# Altium schematic sheet 11-HALF_BRIDGE.SchDoc: INVERTER
size A3; Author: Alexandre Cosneau; CompanyName: Tristar Multicopters; DrawnBy: Alexandre Cosneau; Engineer: Alexandre Cosneau; Organization: Tristar Multicopters; Address1: Genie / GEGI; Address2: 2500 boulevard de l'universite; Address3: J1K2R SHERBROOKE; Address4: QUEBEC, CANADA; DocumentNumber: 4; Revision: 1.0; SheetNumber: 4; SheetTotal: 7
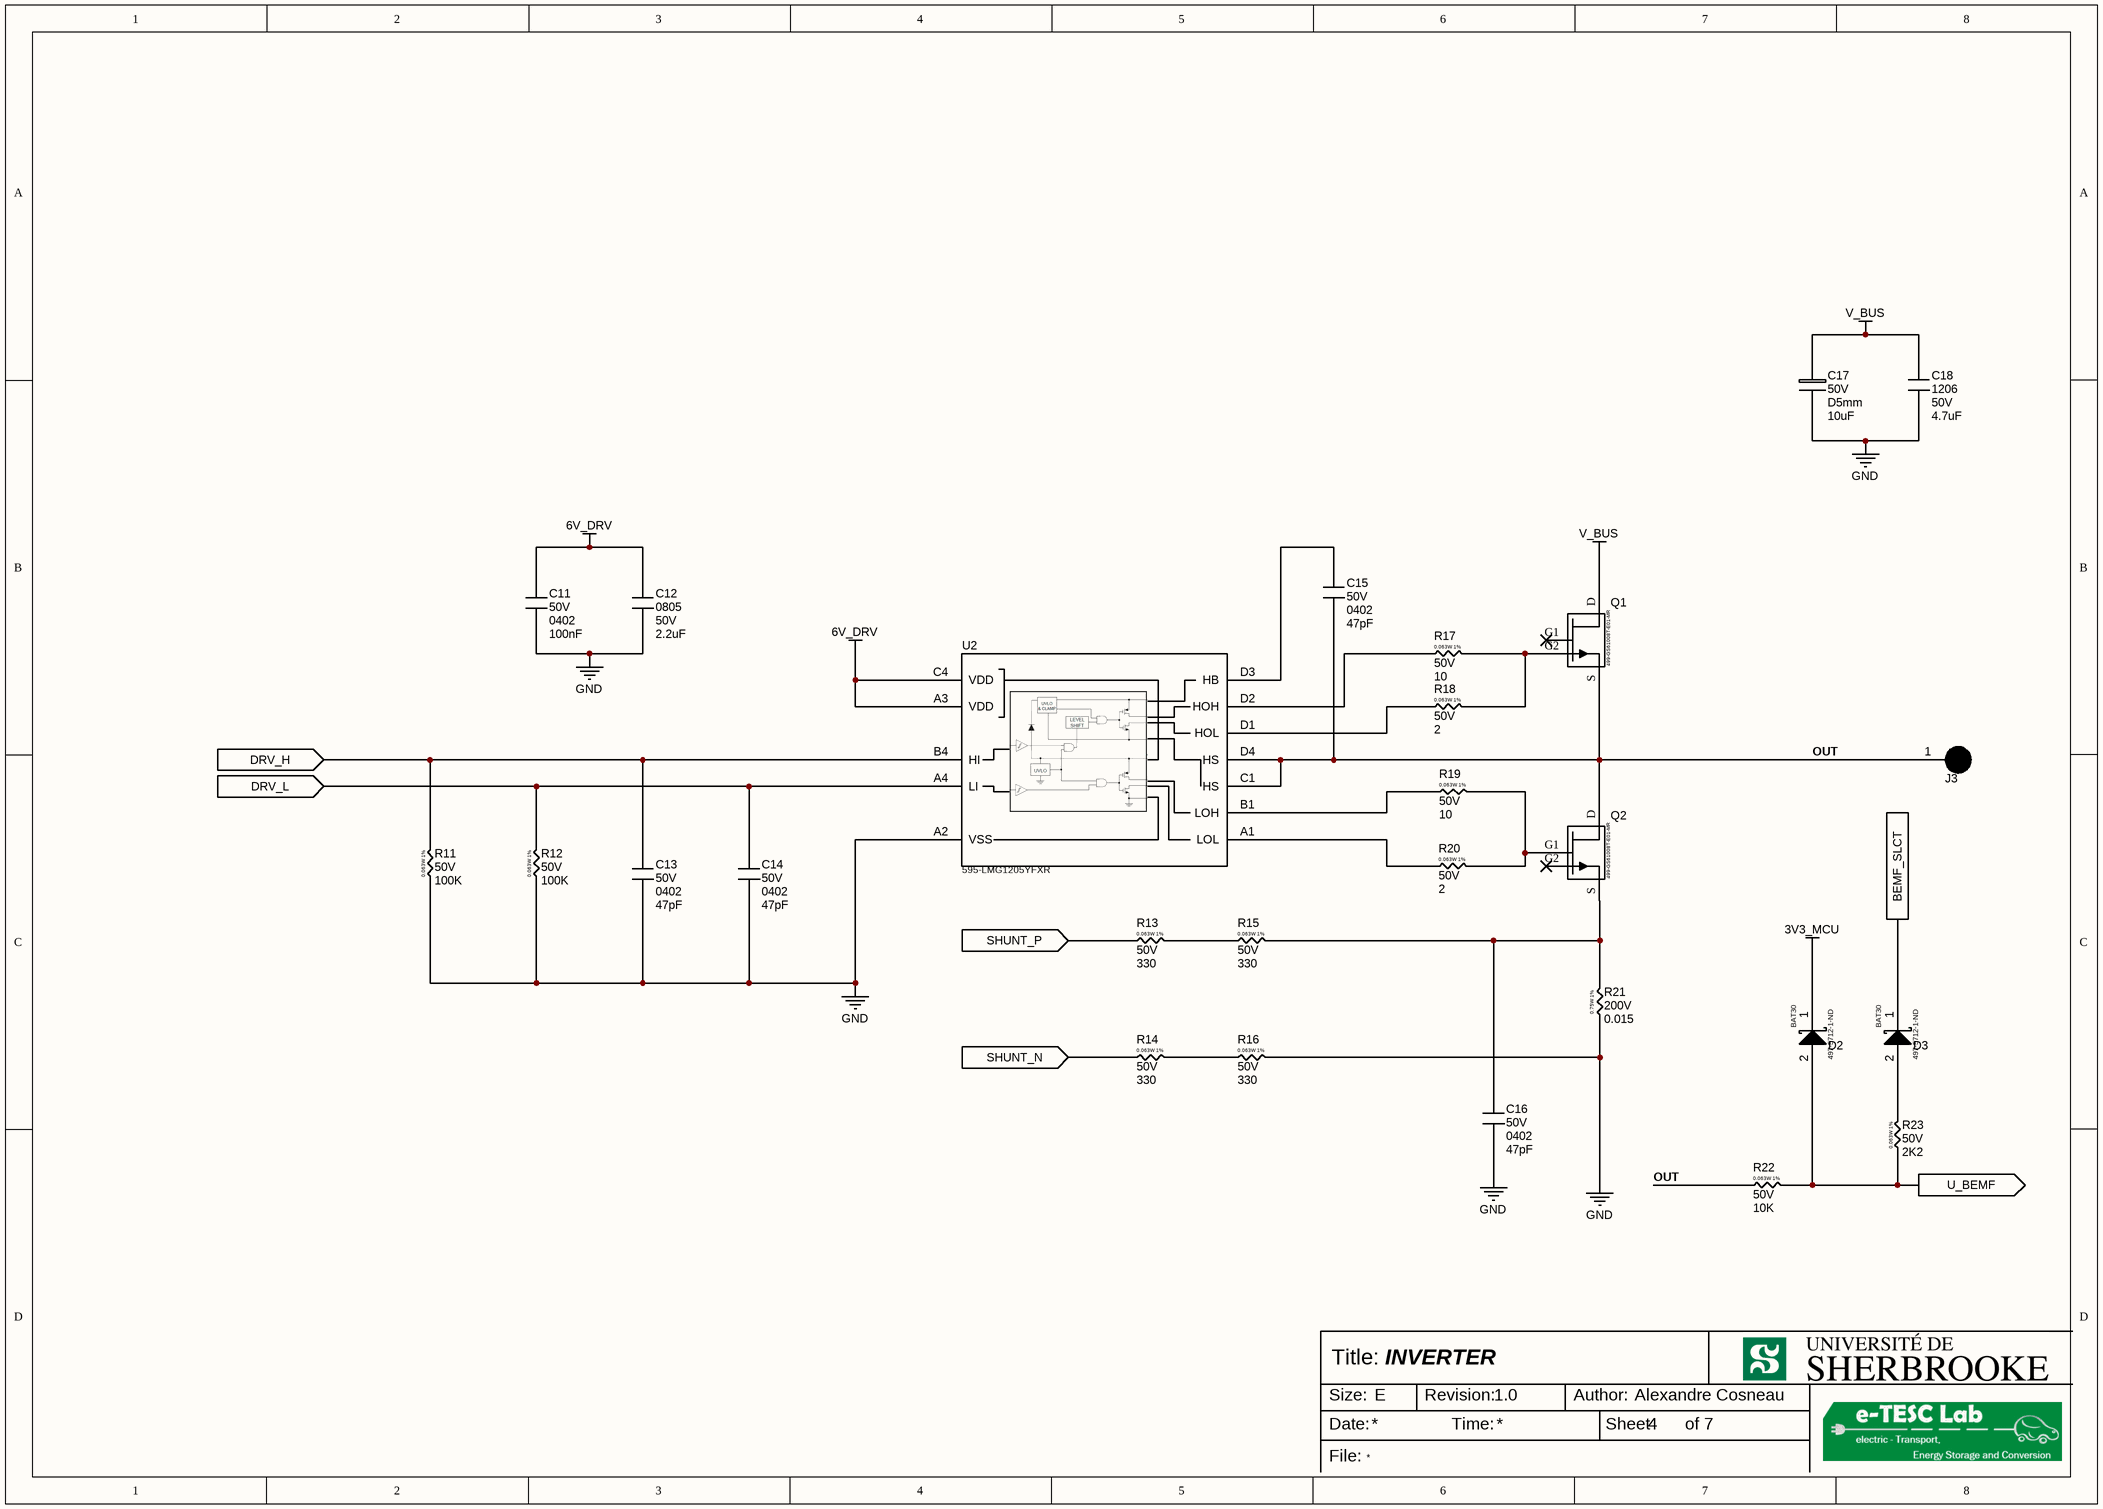
[diagram p0: 11-HALF_BRIDGE.SchDoc]

## Parts
C11  VDC: 50V  Package: 0402  [C 0402(1005)x0.5]  (hidden comment: 100nF)
C12  Package: 0805  VDC: 50V  [C 0805(2012)x0.65]  (hidden comment: 2.2uF)
C13  VDC: 50V  Package: 0402  [C 0402(1005)x0.5]  (hidden comment: 47pF)
C14  VDC: 50V  Package: 0402  [C 0402(1005)x0.5]  (hidden comment: 47pF)
C15  VDC: 50V  Package: 0402  [C 0402(1005)x0.5]  (hidden comment: 47pF)
C16  VDC: 50V  Package: 0402  [C 0402(1005)x0.5]  (hidden comment: 47pF)
C17  VDC: 50V  Package: D5mm  [EL SMD D5 h5.4]  (hidden comment: 10uF)
C18  Package: 1206  VDC: 50V  [C 1206(3216)x1.6]  (hidden comment: 4.7uF)
D2  Supplier Part Number 1: 497-5712-1-ND  [SOD-523]  (hidden comment: SOD523)
D3  Supplier Part Number 1: 497-5712-1-ND  [SOD-523]  (hidden comment: SOD523)
J3  PAD_3_RD  [PAD_03-03-RD]  (value not drawn)  (net tie, no BOM)
Q1  Supplier Part Number 1: 499-GS61008T-E01-MR  [GS61008T]  (hidden comment: GS61008T)
Q2  Supplier Part Number 1: 499-GS61008T-E01-MR  [GS61008T]  (hidden comment: GS61008T)
R11  VDC: 50V  [R 0402(1005)-1%]  (hidden comment: 100K)
R12  VDC: 50V  [R 0402(1005)-1%]  (hidden comment: 100K)
R13  VDC: 50V  [R 0402(1005)-1%]  (hidden comment: 330)
R14  VDC: 50V  [R 0402(1005)-1%]  (hidden comment: 330)
R15  VDC: 50V  [R 0402(1005)-1%]  (hidden comment: 330)
R16  VDC: 50V  [R 0402(1005)-1%]  (hidden comment: 330)
R17  VDC: 50V  [R 0402(1005)-1%]  (hidden comment: 10)
R18  VDC: 50V  [R 0402(1005)-1%]  (hidden comment: 2)
R19  VDC: 50V  [R 0402(1005)-1%]  (hidden comment: 10)
R20  VDC: 50V  [R 0402(1005)-1%]  (hidden comment: 2)
R21  VDC: 200V  [R 2010(5025)-1%]  (hidden comment: 0.015)
R22  VDC: 50V  [R 0402(1005)-1%]  (hidden comment: 10K)
R23  VDC: 50V  [R 0402(1005)-1%]  (hidden comment: 2K2)
U2  Supplier Part Number 2: 595-LMG1205YFXR  [DSBGA-12]  (hidden comment: LMG1205)

## Ports
BEMF_SLCT, DRV_H (in), DRV_L (in), SHUNT_N (in), SHUNT_P (in), U_BEMF (out)

## Nets
3V3_MCU: D2.1
6V_DRV: C11.1 C12.1 U2.A3(VDD) U2.C4(VDD)
GND: C11.2 C12.2 C13.2 C14.2 C16.2 C17.2 C18.2 R11.1 R12.1 R16.2 R21.1 U2.A2(VSS)
V_BUS: C17.1 C18.1 Q1.D
BEMF_SLCT: D3.1 ; port BEMF_SLCT
DRV_H: C13.1 R11.2 U2.B4(HI) ; port DRV_H
DRV_L: C14.1 R12.2 U2.A4(LI) ; port DRV_L
OUT: C15.2 J3.1 Q1.S Q2.D R22.1 U2.C1(HS) U2.D4(HS)
SHUNT_N: R14.1 ; port SHUNT_N
SHUNT_P: R13.1 ; port SHUNT_P
U_BEMF: D2.2 R22.2 R23.1 ; port U_BEMF
NetC15_1: C15.1 U2.D3(HB)
NetC16_1: C16.1 Q2.S R15.2 R21.2
NetD3_2: D3.2 R23.2
NetQ1_G2: Q1.G2 R17.2 R18.2
NetQ2_G1: Q2.G1 R19.2 R20.2
NetR13_2: R13.2 R15.1
NetR14_2: R14.2 R16.1
NetR17_1: R17.1 U2.D2(HOH)
NetR18_1: R18.1 U2.D1(HOL)
NetR19_1: R19.1 U2.B1(LOH)
NetR20_1: R20.1 U2.A1(LOL)

Not connected (* = marked no-connect by the designer): Q1 G1*; Q2 G2*

## Notes on the sheet
- Title:
- Size:
- Date:
- File:
- E
- Revision:
- Time:
- Author:
- Sheet
- of
- (in symbol RES 0402-1%) 0.063W 1%
- (in symbol RES 2010-1%) 0.75W 1%

## Library data of the parts
C11 C13-C16 = CAP 0402 100nF 50V X7R: SMD-0402 100nF 50V X7R 10%; Part Number: CL05B104KB5NNNC; Manufacturer: Samsung; TYPE: Capacitors; Package-mm: 1005; Mount Type: SMT; Publisher: Hefest; Manufacturer Alternate: *; Part Number Alternate: *; Published: 07.04.2019; Supplier 1: Comet; Supplier 2: *; Supplier 3: *; Supplier Part Number 1: C0402 100nF 50V X7R; Supplier Part Number 2: *; Supplier Part Number 3: *; RoHS: Y; Technology: Ceramic  MLCC; Value 1: *; Value 2: *; TempCo: X7R; Tolerance %: ±10%; VAC: *; ESR Ohm: *; ComponentLink1Description: Datasheet link; ComponentLink1URL: https://store.comet.bg/download-file.php?id=11; Temperature Range: -55°C ~ +125°C; Price: 0.039
  C11: Value: 100nF
  C13-C16: Value: 47pF
C12 = CAP 0805 2.2nF 50V X7R: SMD-0805 50V X7R 10%; Part Number: CL21B222KBNC; Manufacturer: Samsung; TYPE: Capacitors; Package-mm: 2012; Mount Type: SMT; Publisher: Hefest; Manufacturer Alternate: *; Part Number Alternate: *; Published: 07.04.2019; Supplier 1: Comet; Supplier 2: *; Supplier 3: *; Supplier Part Number 1: C0805 2.2nF 50V X7R SAMSUNG; Supplier Part Number 2: *; Supplier Part Number 3: *; RoHS: Y; Technology: Ceramic  MLCC; Value 1: *; Value 2: *; TempCo: X7R; Tolerance %: ±10%; VAC: *; ESR Ohm: *; ComponentLink1Description: Datasheet link; ComponentLink1URL: https://store.comet.bg/download-file.php?id=11; Temperature Range: -55°C ~ +125°C; Price: 0.026; Value: 2.2uF
C17 = EL 10uF 50V +105°C: SMD D5mm h5.4mm; Part Number: CK1H100M-CRE54; Manufacturer: Fujicon; Tolerance %: ±20%; TYPE: Capacitors; Load life: 2000h @ +105°C; Mount Type: SMT; Publisher: Hefest; Manufacturer Alternate: *; Part Number Alternate: *; Published: 07.04.2019; Supplier 1: Comet; Supplier 2: *; Supplier 3: *; Supplier Part Number 1: CE 10uF 50V SMD 105C Fujicon; Supplier Part Number 2: *; Supplier Part Number 3: *; RoHS: Y; Technology: Electrolytic Aluminum; Value 1: *; Value 2: *; TempCo: *; VAC: *; ESR Ohm: *; ComponentLink1Description: Datasheet link; ComponentLink1URL: https://store.comet.bg/download-file.php?id=10100; Temperature Range: -40°C ~ +105°C; Price: 0.106; Value: 10uF
C18 = CAP 1206 4.7uF 50V X7R: SMD-1206 50V X7R 10%; Part Number: CL31B475KBHNNNE; Manufacturer: Samsung; TYPE: Capacitors; Package-mm: 3216; Mount Type: SMT; Publisher: Hefest; Manufacturer Alternate: *; Part Number Alternate: *; Published: 07.04.2019; Supplier 1: Comet; Supplier 2: *; Supplier 3: *; Supplier Part Number 1: C1206 4.7uF 50V X7R SAMSUNG; Supplier Part Number 2: *; Supplier Part Number 3: *; RoHS: Y; Technology: Ceramic  MLCC; Value 1: *; Value 2: *; TempCo: X7R; Tolerance %: ±10%; VAC: *; ESR Ohm: *; ComponentLink1Description: Datasheet link; ComponentLink1URL: https://store.comet.bg/download-file.php?id=11; Temperature Range: -55°C ~ +125°C; Price: 0.290; Value: 4.7uF
D2 D3 = BAT30: SCHOTTKY 30V 300mA; Supplier 1: Digi-Key; PACKAGE: SOD523; TYPE: BAT30
J3 = PAD_3_RD: ROUND 3X3 PAD FOR TERMINATION
Q1 Q2 = GS61008T: GAN TRANS E-MODE 100V 90A TOP SIDE COOL; Supplier 1: Mouser
R11-R20 R22 R23 = RES 0402-1%: SMD 0402 0.063W 1% 50V; Manufacturer: YAGEO; TempCo: ±100ppm/°C; Package-mm: 1005; Value Code: 1001; Power: 0.0625W; Part Number: *; Mount Type: SMT; Publisher: Hefest; Manufacturer Alternate: *; Published: 07.04.2019; Supplier 1: Comet; Supplier 2: *; Supplier 3: *; Supplier Part Number 1: R0402 1.0K 1% YAG/ASJ; Supplier Part Number 2: *; Supplier Part Number 3: *; RoHS: Y; Technology: Thick film; Value 2: *; Package: 0402; Tolerance %: ±1%; ComponentLink1Description: Datasheet link; ComponentLink1URL: https://store.comet.bg/download-file.php?id=1224; Temperature Range: -55°C ~ +155°C; Price: 0.015; Part Number Alternate: *; TYPE: Resistor; Value 1: *
  R11 R12: Value: 100K
  R13-R16: Value: 330
  R17 R19: Value: 10
  R18 R20: Value: 2
  R22: Value: 10K
  R23: Value: 2K2
R21 = RES 2010-1%: SMD 2010 0.75W  1% 200V; Manufacturer: YAGEO; TempCo: ±100ppm/°C; Package-mm: 5025; Value Code: 1001; Part Number: *; Mount Type: SMT; Publisher: Hefest; Manufacturer Alternate: *; Published: 07.04.2019; Supplier 1: Comet; Supplier 2: *; Supplier 3: *; Supplier Part Number 1: R2010 1.0K 1% YAG/ASJ; Supplier Part Number 2: *; Supplier Part Number 3: *; RoHS: Y; Technology: Thick film; Value 2: *; Package: 2010; Tolerance %: ±1%; ComponentLink1Description: Datasheet link; ComponentLink1URL: https://store.comet.bg/download-file.php?id=1224; Temperature Range: -55°C ~ +155°C; Price: 0.104; Part Number Alternate: *; TYPE: Resistor; Value 1: *; Power: 0.75W; Value: 0.015
U2 = LMG1205: GaN DRIVER 80V 1MHz; Supplier 1: Digi-Key; Supplier 2: Mouser